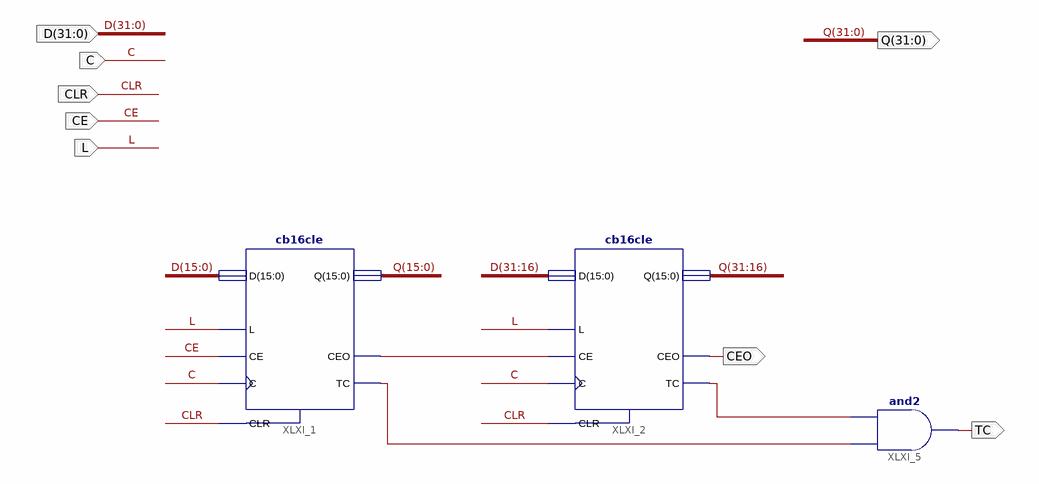
[diagram p0: schematic sheet 1]
// Xilinx ISE schematic counter_32.sch (artix7) as structural Verilog: 3 symbols, 8 ports
module counter_32 (
  input  [31:0] D,
  input  C,
  input  CLR,
  input  CE,
  input  L,
  output TC,
  output [31:0] Q,
  output CEO
);

  wire XLXN_2, XLXN_14, XLXN_15;

  cb16cle XLXI_1 (.C(C), .CE(CE), .CLR(CLR), .D(D[15:0]), .L(L), .CEO(XLXN_2), .Q(Q[15:0]), .TC(XLXN_15));
  cb16cle XLXI_2 (.C(C), .CE(XLXN_2), .CLR(CLR), .D(D[31:16]), .L(L), .CEO(CEO), .Q(Q[31:16]), .TC(XLXN_14));
  and XLXI_5 (TC, XLXN_15, XLXN_14);
endmodule
